# EAGLE design FRDM-Robot-Rev2.1 (EAGLE 6.4)
FRDM-Robot Board
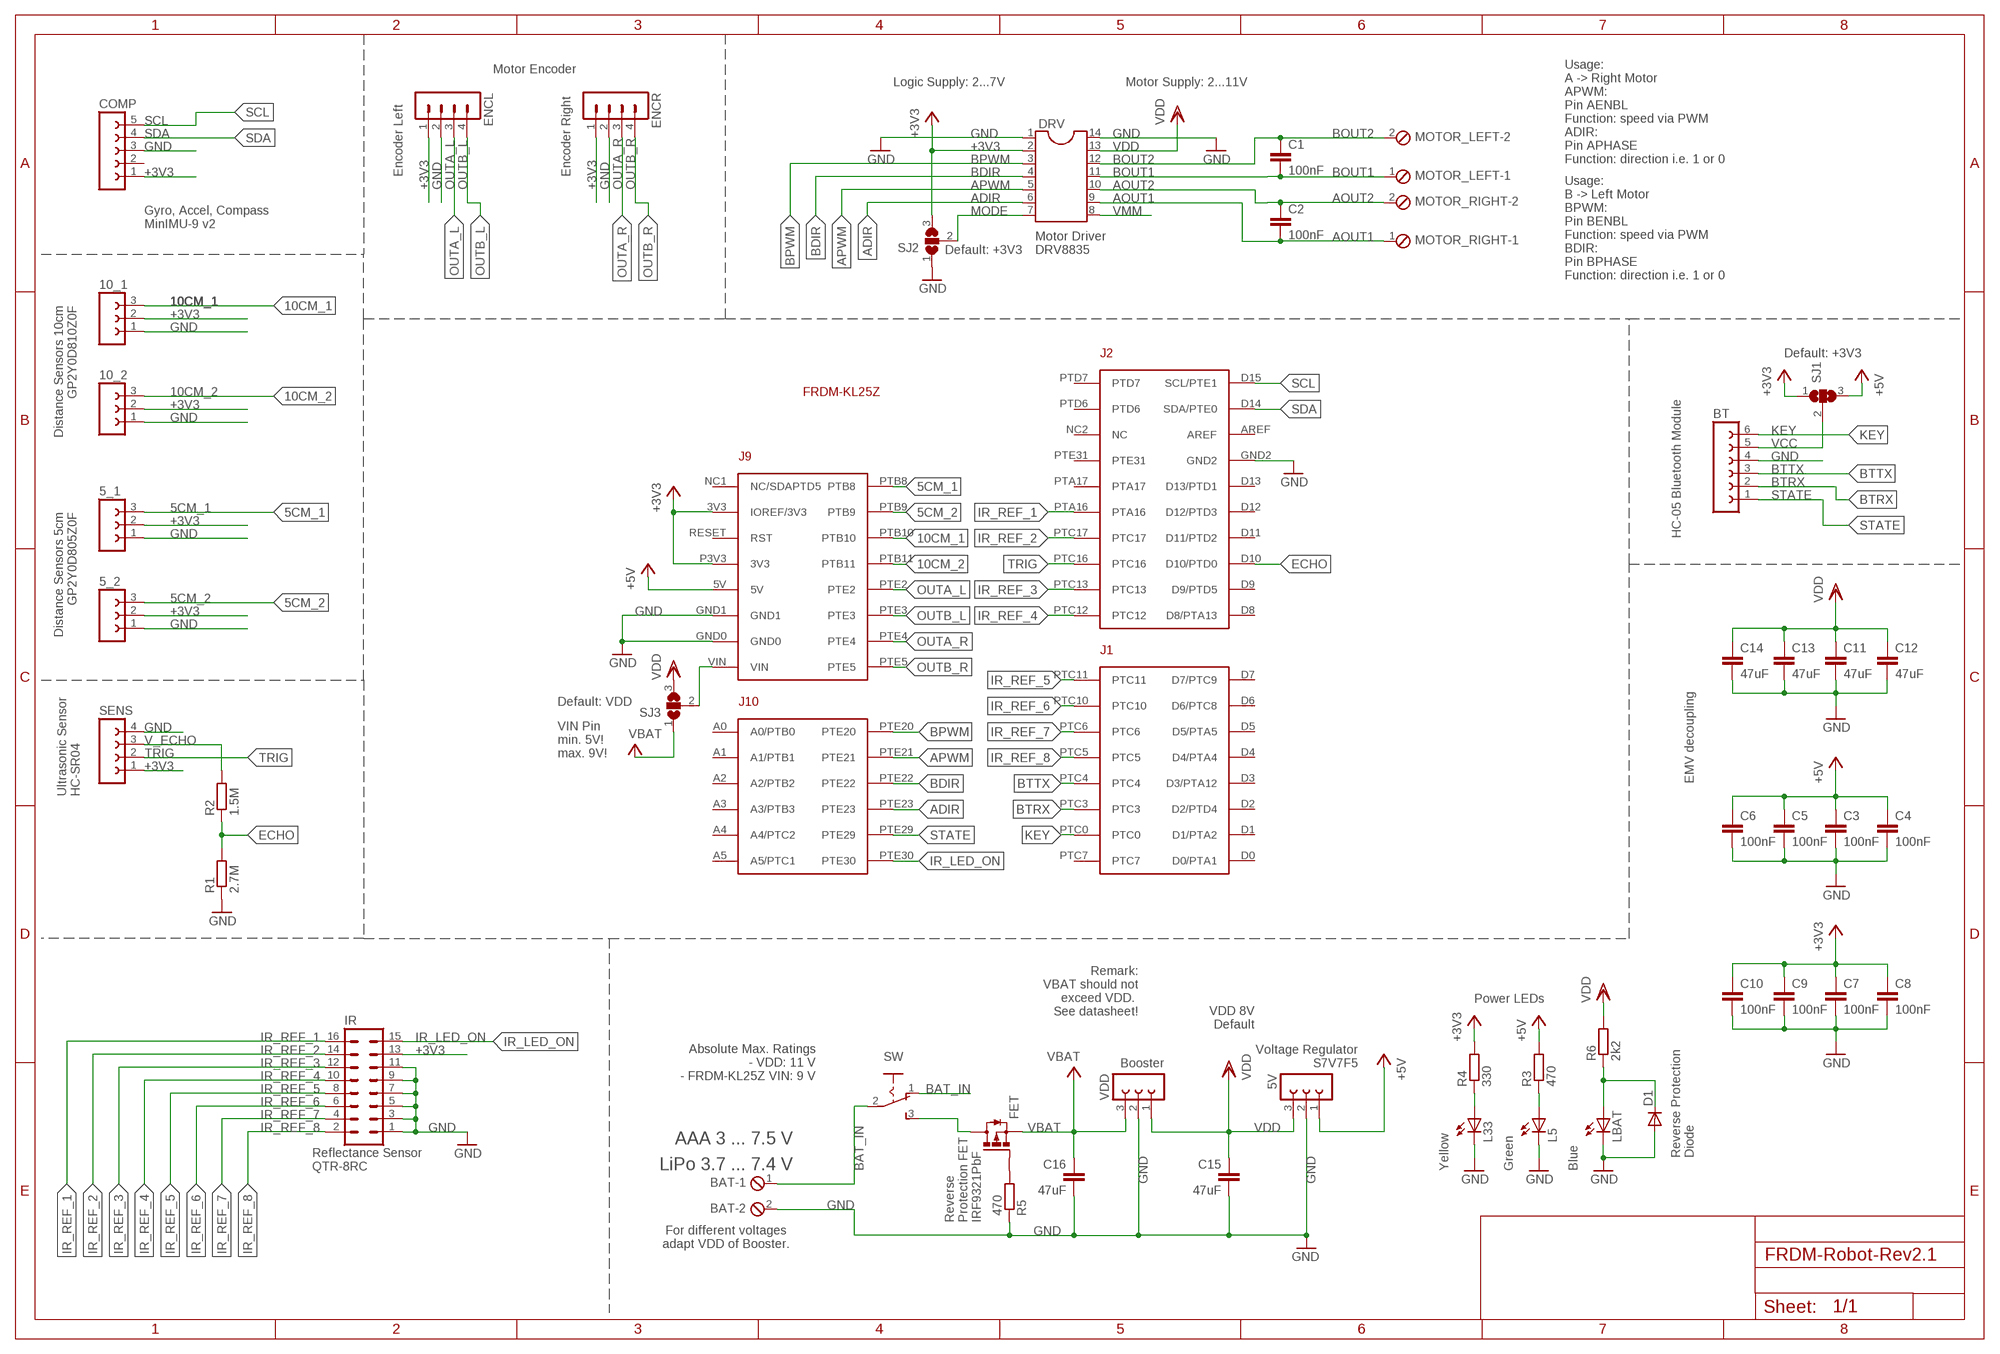
[diagram p0: schematic, sheet 1]

## Parts
5_1  FE03-1  [FE03-1]
5_2  FE03-1  [FE03-1]
5V  FE03-1  [FE03-1]
10_1  FE03-1  [FE03-1]
10_2  FE03-1  [FE03-1]
BAT  MPT2  [2POL254]
BT  FE06-1  [FE06]
C1  100nF  C-EUC0805  [C0805]
C2  100nF  C-EUC0805  [C0805]
C3  100nF  C-EUC0805  [C0805]
C4  100nF  C-EUC0805  [C0805]
C5  100nF  C-EUC0805  [C0805]
C6  100nF  C-EUC0805  [C0805]
C7  100nF  C-EUC0805  [C0805]
C8  100nF  C-EUC0805  [C0805]
C9  100nF  C-EUC0805  [C0805]
C10  100nF  C-EUC0805  [C0805]
C11  47uF  C-EUC0805  [C0805]
C12  47uF  C-EUC0805  [C0805]
C13  47uF  C-EUC0805  [C0805]
C14  47uF  C-EUC0805  [C0805]
C15  47uF  C-EUC0805  [C0805]
C16  47uF  C-EUC0805  [C0805]
COMP  FE05-1  [FE05-1]
D1  DIODE-SOD123  [SOD123]
DRV  DIL14  [DIL14]
ENCL  MA04-1  [MA04-1]
ENCR  MA04-1  [MA04-1]
FET  P-MOSFET-SO8  [SO-08]
FRDM1  FRDM-KL25ZARDUINO  [FRDM-KL25Z]
IR  MA08-2  [MA08-2]
L5  LEDCHIP-LED0603  [CHIP-LED0603]
L33  LEDCHIP-LED0603  [CHIP-LED0603]
LBAT  LEDCHIP-LED0603  [CHIP-LED0603]
MOTOR_LEFT  MPT2  [2POL254]
MOTOR_RIGHT  MPT2  [2POL254]
R1  2.7M  R-EU_M0805  [M0805]
R2  1.5M  R-EU_M0805  [M0805]
R3  470  R-EU_M0805  [M0805]
R4  330  R-EU_M0805  [M0805]
R5  470  R-EU_M0805  [M0805]
R6  2k2  R-EU_M0805  [M0805]
SENS  FE04-1  [FE04-1]
SJ1  SJ2W  [SJ_2]
SJ2  SJ2W  [SJ_2]
SJ3  SJ2W  [SJ_2]
SW  KNITTER-MFP106D  [KNITTER-MFP106D]
VDD  FE03-1  [FE03-1]

## Nets
5CM_1: 5_1.3 FRDM1.PTB8
5CM_2: 5_2.3 FRDM1.PTB9
10CM_1: 10_1.3 FRDM1.PTB10
10CM_2: 10_2.3 FRDM1.PTB11
+3V3: 5_1.2 5_2.2 10_1.2 10_2.2 C7.1 C8.1 C9.1 C10.1 COMP.1 DRV.2 ENCL.1 ENCR.1 FRDM1.3V3(IOREF/3V3) FRDM1.P3V3(3V3) IR.13 R4.2 SENS.1 SJ1.1 SJ2.3
+5V: 5V.1 C3.1 C4.1 C5.1 C6.1 FRDM1.5V R3.2 SJ1.3
ADIR: DRV.6 FRDM1.PTE23
AOUT1: C2.2 DRV.9 MOTOR_RIGHT.1
AOUT2: C2.1 DRV.10 MOTOR_RIGHT.2
APWM: DRV.5 FRDM1.PTE21
BAT-FET: FET.5(D) FET.6(D) FET.7(D) FET.8(D) SW.3(S)
BAT_IN: BAT.1 SW.1(O) SW.2(P)
BDIR: DRV.4 FRDM1.PTE22
BOUT1: C1.2 DRV.11 MOTOR_LEFT.1
BOUT2: C1.1 DRV.12 MOTOR_LEFT.2
BPWM: DRV.3 FRDM1.PTE20
BTRX: BT.2 FRDM1.PTC3
BTTX: BT.3 FRDM1.PTC4
ECHO: FRDM1.D10(D10/PTD0) R1.2 R2.1
GND: 5_1.1 5_2.1 5V.2 10_1.1 10_2.1 BAT.2 BT.4 C3.2 C4.2 C5.2 C6.2 C7.2 C8.2 C9.2 C10.2 C11.2 C12.2 C13.2 C14.2 C15.2 C16.2 COMP.3 D1.A DRV.1 DRV.14 ENCL.2 ENCR.2 FRDM1.GND0 FRDM1.GND1 FRDM1.GND2 IR.1 IR.3 IR.5 IR.7 IR.9 IR.11 L5.C L33.C LBAT.C R1.1 R5.1 SENS.4 SJ2.1 VDD.2
IR_LED_ON: FRDM1.PTE30 IR.15
IR_REF_1: FRDM1.PTA16 IR.16
IR_REF_2: FRDM1.PTC17 IR.14
IR_REF_3: FRDM1.PTC13 IR.12
IR_REF_4: FRDM1.PTC12 IR.10
IR_REF_5: FRDM1.PTC11 IR.8
IR_REF_6: FRDM1.PTC10 IR.6
IR_REF_7: FRDM1.PTC6 IR.4
IR_REF_8: FRDM1.PTC5 IR.2
KEY: BT.6 FRDM1.PTC0
MODE: DRV.7 SJ2.2
N$1: L5.A R3.1
N$3: L33.A R4.1
N$5: FET.4(G) R5.2
N$6: D1.C LBAT.A R6.1
OUTA_L: ENCL.3 FRDM1.PTE2
OUTA_R: ENCR.3 FRDM1.PTE4
OUTB_L: ENCL.4 FRDM1.PTE3
OUTB_R: ENCR.4 FRDM1.PTE5
SCL: COMP.5 FRDM1.D15(SCL/PTE1)
SDA: COMP.4 FRDM1.D14(SDA/PTE0)
STATE: BT.1 FRDM1.PTE29
TRIG: FRDM1.PTC16 SENS.2
V_ECHO: R2.2 SENS.3
VBAT: C16.1 FET.1(S) FET.2(S) FET.3(S) SJ3.1 VDD.3
VCC: BT.5 SJ1.2
VDD: 5V.3 C11.1 C12.1 C13.1 C14.1 C15.1 DRV.13 R6.2 SJ3.3 VDD.1
VIN: FRDM1.VIN SJ3.2
VMM: DRV.8
Unconnected: COMP.2 FRDM1.A0(A0/PTB0) FRDM1.A1(A1/PTB1) FRDM1.A2(A2/PTB2) FRDM1.A3(A3/PTB3) FRDM1.A4(A4/PTC2) FRDM1.A5(A5/PTC1) FRDM1.AREF FRDM1.D0(D0/PTA1) FRDM1.D1(D1/PTA2) FRDM1.D2(D2/PTD4) FRDM1.D3(D3/PTA12) FRDM1.D4(D4/PTA4) FRDM1.D5(D5/PTA5) FRDM1.D6(D6/PTC8) FRDM1.D7(D7/PTC9) FRDM1.D8(D8/PTA13) FRDM1.D9(D9/PTD5) FRDM1.D11(D11/PTD2) FRDM1.D12(D12/PTD3) FRDM1.D13(D13/PTD1) FRDM1.NC1(NC/SDAPTD5) FRDM1.NC2(NC) FRDM1.PTA17 FRDM1.PTC7 FRDM1.PTD6 FRDM1.PTD7 FRDM1.PTE31 FRDM1.RESET(RST)

## Notes on the sheet
- Motor Encoder
- Logic Supply: 2...7V | Motor Supply: 2...11V
- Usage:
  A -> Right Motor
  APWM: 
  Pin AENBL 
  Function: speed via PWM
  ADIR: 
  Pin APHASE 
  Function: direction i.e. 1 or 0
- Encoder Left | Encoder Right
- Gyro, Accel, Compass
  MinIMU-9 v2
- Default: +3V3
- Motor Driver
  DRV8835
- Usage:
  B -> Left Motor
  BPWM: 
  Pin BENBL 
  Function: speed via PWM
  BDIR: 
  Pin BPHASE 
  Function: direction i.e. 1 or 0
- Distance Sensors 10cm
  GP2Y0D810Z0F
- Default: +3V3
- Distance Sensors 5cm
  GP2Y0D805Z0F
- HC-05 Bluetooth Module
- Default: VDD
- VIN Pin
  min. 5V!
  max. 9V!
- EMV decoupling
- Ultrasonic Sensor
  HC-SR04
- Power LEDs
- Remark:
  VBAT should not
  exceed VDD. 
  See datasheet!
- VDD 8V
  Default
- Booster
- Voltage Regulator
  S7V7F5
- Absolute Max. Ratings
  - VDD: 11 V
  - FRDM-KL25Z VIN: 9 V
- AAA 3 ... 7.5 V
- Reverse Protection
  Diode
- Reflectance Sensor
  QTR-8RC
- LiPo 3.7 ... 7.4 V | Yellow | Green | Blue
- Reverse
  Protection FET
  IRF9321PbF
- For different voltages 
  adapt VDD of Booster.

## Library data of the parts
5_1 5_2 5V 10_1 10_2 VDD = con-lsta-FRDM:FE03-1: Female Header
BAT MOTOR_LEFT MOTOR_RIGHT = con-phoenix-254-FRDM:MPT2: PHOENIX CONNECTOR; OC_FARNELL: unknown; OC_NEWARK: unknown
BT = con-lsta-FRDM:FE06-1: FEMALE HEADER; OC_FARNELL: unknown; OC_NEWARK: unknown
C1-C16 = rcl:C-EU: CAPACITOR, European symbol
COMP = con-lsta-FRDM:FE05-1: FEMALE HEADER; OC_FARNELL: unknown; OC_NEWARK: unknown
D1 = diode:DIODE-: DIODE
DRV = ic-package-FRDM:DIL14: Dual In Line / Socket
ENCL ENCR = con-lstb-FRDM:MA04-1: PIN HEADER; OC_FARNELL: unknown; OC_NEWARK: unknown
FET = transistor-power-IRF-FRDM:P-MOSFET-SO8: P-Channel MOSFET Example: FDS4435A; P-Channel Logic Level PowerTrench® MOSFET FDS4465; P-Channel 1.8V Specified PowerTrench® MOSFET Source: www.fairchildsemi.com
FRDM1 = Freedom:FRDM-KL25Z: For creating FRDM-KL25Z shields
IR = con-lstb-FRDM:MA08-2: PIN HEADER; OC_FARNELL: unknown; OC_NEWARK: unknown
L5 L33 LBAT = led:LED: LED OSRAM: - CHIPLED LG R971, LG N971, LY N971, LG Q971, LY Q971, LO R971, LY R971 LH N974, LH R974 LS Q976, LO Q976, LY Q976 LO Q996 - Hyper CHIPLED LW Q18S LB Q993, LB Q99A, LB R99A - SideLED LS A670, LO A670, LY A670, LG A670, LP A670 LB A673, LV A673, LT A673, LW A673 LH A674 LY A675 LS A676, LA A676, LO A676, LY A676, LW A676 LS A679, LY A679, LG A679 - Hyper Micro SIDELED® LS Y876, LA Y876, LO Y876, LY Y876 LT Y87S - SmartLED LW L88C, LW L88S LB L89C, LB L89S, LG L890 LS L89K, LO L89K, LY L89K LS L896, LA L896, LO L896, LY L896 - TOPLED LS T670, LO T670, LY T670, LG T670, LP T670 LSG T670, LSP T670, LSY T670, LOP T670, LYG T670 LG T671, LOG T671, LSG T671 LB T673, LV T673, LT T673, LW T673 LH T674 LS T676, LA T676, LO T676, LY T676, LB T676, LH T676, LSB T676, LW T676 LB T67C, LV T67C, LT T67C, LS T67K, LO T67K, LY T67K, LW E67C LS E67B, LA E67B, LO E67B, LY E67B, LB E67C, LV E67C, LT E67C LW T67C LS T679, LY T679, LG T679 LS T770, LO T770, LY T770, LG T770, LP T770 LB T773, LV T773, LT T773, LW T773 LH T774 LS E675, LA E675, LY E675, LS T675 LS T776, LA T776, LO T776, LY T776, LB T776 LHGB T686 LT T68C, LB T68C - Hyper Mini TOPLED® LB M676 - Mini TOPLED Santana® LG M470 LS M47K, LO M47K, LY M47K Source: http://www.osram.convergy.de LUXEON: - LUMILED® LXK2-PW12-R00, LXK2-PW12-S00, LXK2-PW14-U00, LXK2-PW14-V00 LXK2-PM12-R00, LXK2-PM12-S00, LXK2-PM14-U00 LXK2-PE12-Q00, LXK2-PE12-R00, LXK2-PE12-S00, LXK2-PE14-T00, LXK2-PE14-U00 LXK2-PB12-K00, LXK2-PB12-L00, LXK2-PB12-M00, LXK2-PB14-N00, LXK2-PB14-P00, LXK2-PB14-Q00 LXK2-PR12-L00, LXK2-PR12-M00, LXK2-PR14-Q00, LXK2-PR14-R00 LXK2-PD12-Q00, LXK2-PD12-R00, LXK2-PD12-S00 LXK2-PH12-R00, LXK2-PH12-S00 LXK2-PL12-P00, LXK2-PL12-Q00, LXK2-PL12-R00 Source: www.luxeon.com KINGBRIGHT: KA-3528ASYC Source: www.kingbright.com
R1-R6 = resistor:R-EU_: RESISTOR, European symbol
SENS = con-lsta-FRDM:FE04-1: Female Header
SJ1-SJ3 = jumper:SJ2W: SMD solder JUMPER
SW = switch-FRDM:KNITTER-MFP106D: SLIDING SWITCH Knitter-Switch MFP 106 D Farnell <http://ch.farnell.com/knitter-switch/mfp106d/schiebeschalter-ein-ein/dp/807527>; FARNELL: 807527

## Net classes
0 default: clearance 0.025 mm

## Board
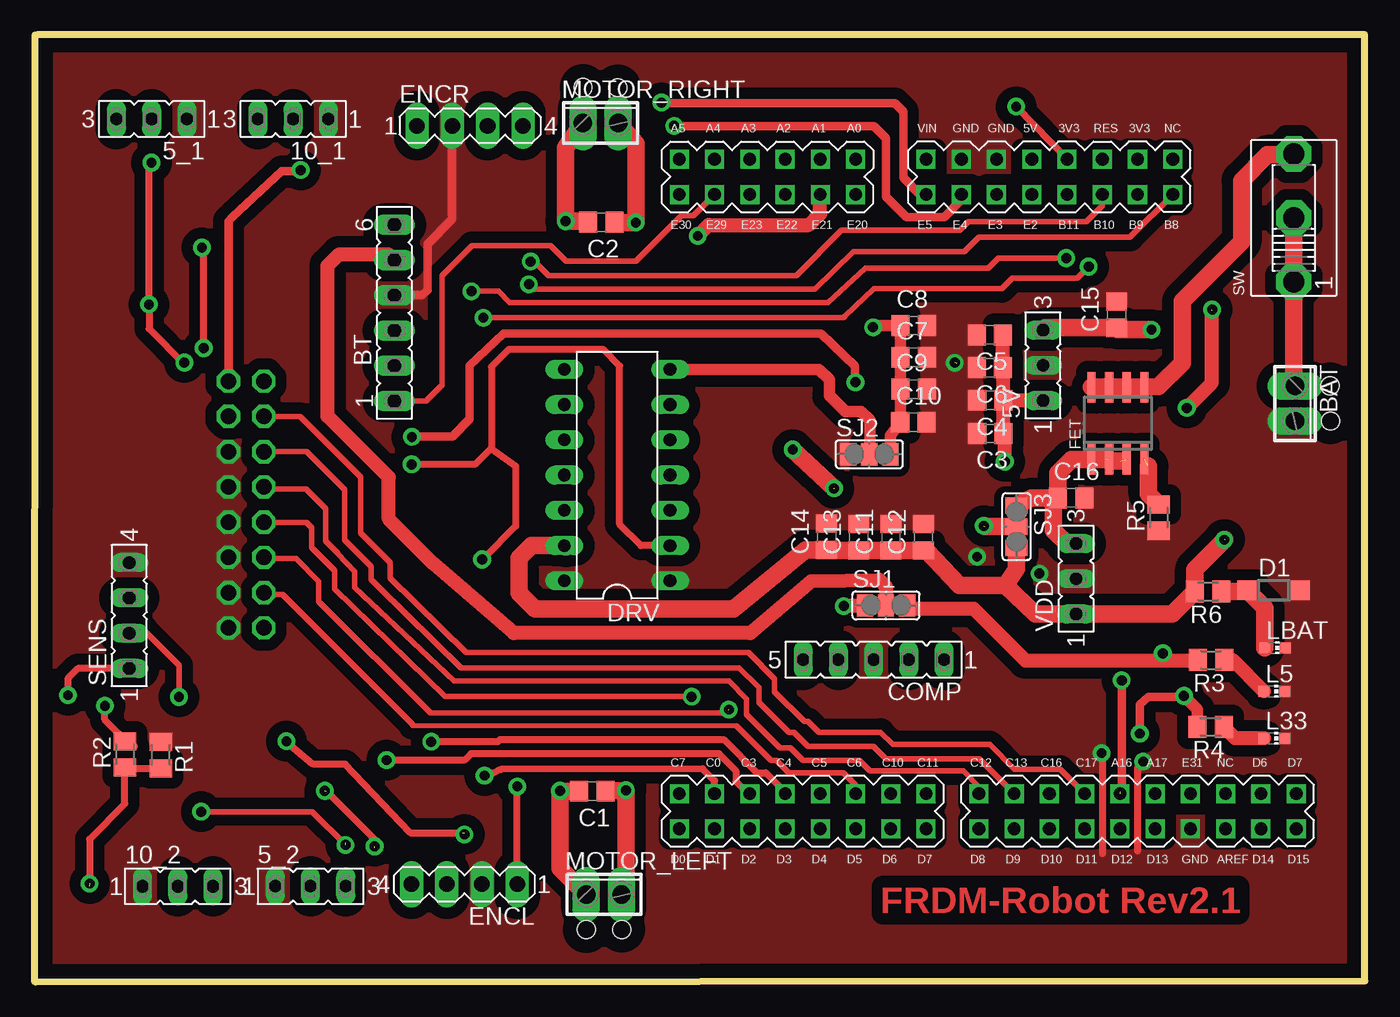
[diagram p1: board, top side]
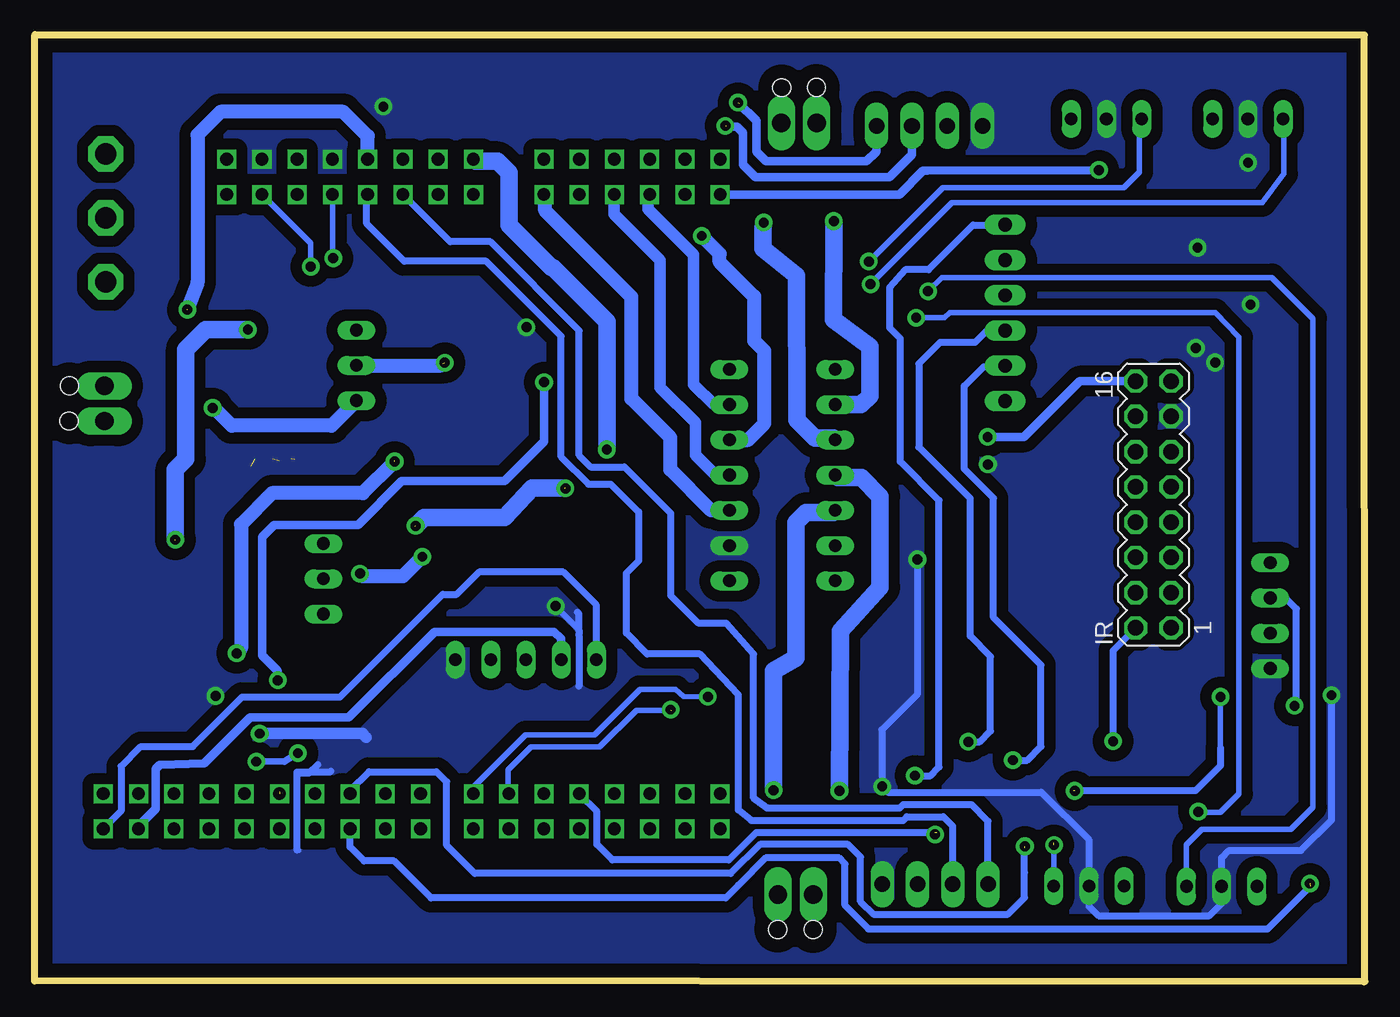
[diagram p2: board, bottom side, seen from below]

Size 95.84 x 68.27 mm. Coordinates in mm from the lower left corner, seen from the top.
Outline: 0.04,0 95.84,0.07 95.83,68.27 0.14,68.25
Outline: 0,0.02 0.03,68.24
Copper layers (1*16): Top 0.035mm / dielectric 1.5mm / Bottom 0.035mm
Design rules "default *": minimum track width 10mil, minimum drill 24mil, track to track 3mil, track to pad 3mil, pad to pad 3mil, via to via 3mil, smd to smd 3mil, copper to edge 40mil, drill to drill 5mil, minimum pad ring 5mil, minimum via ring 4mil, stop-mask expansion 3mil, vias tented up to drill 0mil, thermal gap 10mil
Holes 1.3 mm at 39.74,3.79 42.3,3.79 93.36,40.42 93.34,42.96 39.51,64.46 42.01,64.44

### Footprints (pad centres in the part's own frame; a part is rotated, then mirrored left to right if it is on the bottom)
FE03-1 = drill 0.914 long: 1 -2.54,0; 2 0,0; 3 2.54,0
2POL254 = drill 1.321 long: 1 -1.27,0; 2 1.27,0
FE06 = drill 0.991 long: 1 -6.35,0; 2 -3.81,0; 3 -1.27,0; 4 1.27,0; 5 3.81,0; 6 6.35,0
C0805 = smd 1.3 x 1.5: 1 -0.95,0; 2 0.95,0
FE05-1 = drill 0.914 long: 1 -5.08,0; 2 -2.54,0; 3 0,0; 4 2.54,0; 5 5.08,0
SOD123 = smd 1.4 x 1.4: A 1.9,0; C -1.9,0
DIL14 = drill 0.914 long: 1 -7.62,-3.81; 2 -5.08,-3.81; 3 -2.54,-3.81; 4 0,-3.81; 5 2.54,-3.81; 6 5.08,-3.81; 7 7.62,-3.81; 8 7.62,3.81; 9 5.08,3.81; 10 2.54,3.81; 11 0,3.81; 12 -2.54,3.81; 13 -5.08,3.81; 14 -7.62,3.81
MA04-1 = drill 1.118 long: 1 -3.81,0; 2 -1.27,0; 3 1.27,0; 4 3.81,0
SO-08 = smd 0.6 x 2.2: 1 -1.905,-2.6; 2 -0.635,-2.6; 3 0.635,-2.6; 4 1.905,-2.6; 5 1.905,2.6; 6 0.635,2.6; 7 -0.635,2.6; 8 -1.905,2.6
FRDM-KL25Z = drill 0.914 square: 3V3 -22.86,12.7; 5V -22.86,5.08; A0 -22.86,-7.62; A1 -22.86,-10.16; A2 -22.86,-12.7; A3 -22.86,-15.24; A4 -22.86,-17.78; A5 -22.86,-20.32; AREF 25.4,19.05; D0 25.4,-20.32; D1 25.4,-17.78; D2 25.4,-15.24; D3 25.4,-12.7; D4 25.4,-10.16; D5 25.4,-7.62; D6 25.4,-5.08; D7 25.4,-2.54; D8 25.4,1.27; D9 25.4,3.81; D10 25.4,6.35; D11 25.4,8.89; D12 25.4,11.43; D13 25.4,13.97; D14 25.4,21.59; D15 25.4,24.13; GND0 -22.86,0; GND1 -22.86,2.54; GND2 25.4,16.51; NC1 -22.86,15.24; NC2 22.86,19.05; P3V3 -22.86,7.62; PTA16 22.86,11.43; PTA17 22.86,13.97; PTB8 -20.32,15.24; PTB9 -20.32,12.7; PTB10 -20.32,10.16; PTB11 -20.32,7.62; PTC0 22.86,-17.78; PTC3 22.86,-15.24; PTC4 22.86,-12.7; PTC5 22.86,-10.16; PTC6 22.86,-7.62; PTC7 22.86,-20.32; PTC10 22.86,-5.08; PTC11 22.86,-2.54; PTC12 22.86,1.27; PTC13 22.86,3.81; PTC16 22.86,6.35; PTC17 22.86,8.89; PTD6 22.86,21.59; PTD7 22.86,24.13; PTE2 -20.32,5.08; PTE3 -20.32,2.54; PTE4 -20.32,0; PTE5 -20.32,-2.54; PTE20 -20.32,-7.62; PTE21 -20.32,-10.16; PTE22 -20.32,-12.7; PTE23 -20.32,-15.24; PTE29 -20.32,-17.78; PTE30 -20.32,-20.32; PTE31 22.86,16.51; RESET -22.86,10.16; VIN -22.86,-2.54
MA08-2 = drill 1.118 octagon: 1 -8.89,-1.27; 2 -8.89,1.27; 3 -6.35,-1.27; 4 -6.35,1.27; 5 -3.81,-1.27; 6 -3.81,1.27; 7 -1.27,-1.27; 8 -1.27,1.27; 9 1.27,-1.27; 10 1.27,1.27; 11 3.81,-1.27; 12 3.81,1.27; 13 6.35,-1.27; 14 6.35,1.27; 15 8.89,-1.27; 16 8.89,1.27
CHIP-LED0603 = smd 0.8 x 0.8: A 0,-0.75; C 0,0.75
M0805 = smd 1.3 x 1.6: 1 -0.95,0; 2 0.95,0
FE04-1 = drill 0.914 long: 1 -5.08,0; 2 -2.54,0; 3 0,0; 4 2.54,0
SJ_2 = smd 1.168 x 1.6: 1 -1.524,0; 2 0,0; 3 1.524,0
KNITTER-MFP106D = drill 1.524 pad 2.54 octagon: 1 -4.61,0; 2 0,0; 3 4.61,0

### Placement (x,y rotation side)
5_1  8.43,62.2 180 top
5_2  19.88,6.9 0 top
5V  72.65,44.44 90 top
10_1  18.62,62.19 180 top
10_2  10.31,6.89 0 top
BAT  90.82,41.69 270 top
BT  25.92,48.22 90 top
C1  40.19,13.75 180 top
C2  40.83,54.75 180 top
C3  68.86,39.53 180 top
C4  68.86,41.93 180 top
C5  68.83,46.63 180 top
C6  68.83,44.27 180 top
C7  63.34,45.02 0 top
C8  63.34,47.31 0 top
C9  63.33,42.72 0 top
C10  63.31,40.34 0 top
C11  61.69,32.05 90 top
C12  64.04,32.04 90 top
C13  59.37,32.06 90 top
C14  57.06,32.08 90 top
C15  77.95,48.09 90 top
C16  74.68,34.89 0 top
COMP  60.44,23.22 180 top
D1  89.27,28.23 0 top
DRV  41.97,36.53 90 top
ENCL  30.96,7.04 180 top
ENCR  31.36,61.71 0 top
FET  78.04,40.27 0 top
FRDM1  66.77,36.43 270 top
IR  15.23,34.41 90 bottom
L5  89.32,20.95 270 top
L33  89.32,17.56 270 top
LBAT  89.37,24.08 270 top
MOTOR_LEFT  41.01,6.31 0 top
MOTOR_RIGHT  40.77,61.92 0 top
R1  9.1,16.36 270 top
R2  6.5,16.4 90 top
R3  84.77,23.21 180 top
R4  84.72,18.39 180 top
R5  80.99,33.47 90 top
R6  84.54,28.14 180 top
SENS  6.81,27.68 90 top
SJ1  61.34,27.14 0 top
SJ2  60.13,38.04 0 top
SJ3  70.75,32.81 270 top
SW  90.73,55.07 90 top
VDD  75.03,29.06 90 top

### Tracks (layer width: path | path; a pad name or v marks a point on that pad's centre or on a via)
5CM_1  (via drill 0.71 pad 1.27)
  Top 0.406: v35.61,50.29 35.96,49.94 56.23,49.94 58.98,52.62 66.99,52.62 68.03,53.66 78.92,53.66 FRDM1.PTB8
  Bottom 0.406: 5_1.3 5.82,62.13 5.82,58.24 7.4,56.16 28.57,56.16 | 28.57,56.15 28.57,56.16 | v35.61,50.29 29.73,56.16 28.57,56.16
5CM_2  (via drill 0.71 pad 1.27)  (1 unrouted)
  Top 0.406: v32.33,47.87 58.26,47.87 58.37,47.98 60.48,49.96 69.68,49.96 70.44,50.72 75.11,50.72 v75.95,51.56 | v22.4,9.88 20,12.28 v12,12.28
  Bottom 0.406: 5_2.3 22.41,10.02 | v32.33,47.87 30.28,47.87 29.91,48.25 10.78,48.25 9.07,46.48 9.07,13.56 10.42,12.21 11.93,12.21 v12,12.28 | v75.95,51.56 75.95,53.24 FRDM1.PTB9
10CM_1  (via drill 0.71 pad 1.27)
  Top 0.406: FRDM1.PTB10 76.93,55.94 75.78,54.78 67.29,54.78 66.68,54.17 58.15,54.17 54.89,50.91 37.03,50.91 36.02,51.92 v35.74,51.92
  Bottom 0.406: 10_1.3 16.26,62.01 16.26,58.36 17.38,57.25 30.42,57.25 v35.74,51.92
  Bottom 0.61: 16.24,62.04 10_1.3
10CM_2  (via drill 0.71 pad 1.27)
  Top 0.406: v74.33,52.17 69.42,52.17 68.71,51.45 59.87,51.45 57.17,48.96 34.23,48.96 33.41,49.78 v31.47,49.78
  Bottom 0.406: FRDM1.PTB11 74.39,52.23 v74.33,52.17 | 10_2.3 12.85,9.88 11.74,10.99 5.34,10.99 3.74,12.6 3.74,47.82 6.69,50.77 30.48,50.77 v31.47,49.78
  Bottom 0.61: 74.39,52.23 74.43,52.19
+3V3  (via drill 0.71 pad 1.27)
  Top 0.406: 8.42,48.64 v8.24,48.83
  Top 0.508: v70.72,63.09 74.4,59.31 FRDM1.P3V3 | DRV.2 43.68,31.45 42.15,32.99 42.15,44.4 40.94,45.61 34.16,45.61 32.91,44.35 32.91,38.48 32.87,38.45 | 32.87,38.45 31.73,37.31 v27.16,37.31 | 32.87,38.45 34.65,37.18 34.65,32.86 32.37,30.57 | v12.17,45.69 12.17,52.8 v12.05,52.93 | ENCL.1 34.77,13.68 v34.78,14.09 | 10.78,44.55 8.24,47.09 v8.24,48.83 8.24,58.87 v8.41,59.04 | SENS.1 3.12,22.6 2.4,21.88 v2.4,20.68
  Top 0.61: v82.81,20.62 82.73,20.54 80.25,20.54 79.63,20 v79.63,17.9 | 34.86,6.95 ENCL.1
  Top 0.813: R4.2 83.77,19.66 v82.81,20.62 | SJ2.3 61.66,39.38 C10.1 62.38,40.35 C9.1 62.39,42.73 C7.1 C8.1 60.53,47.31 v60.41,47.19
  Top 1.016: SJ1.1 59.77,27.09 v58.3,27.09
  Bottom 0.406: 56.62,24.99 56.62,25.06 | 56.62,25.37 58.27,27.02 | 76.82,9.49 76.94,9.49
  Bottom 0.508: 56.62,24.99 56.62,21.3 | 76.94,9.49 76.94,15.08 76.03,15.08 75.98,15.13 | 76.94,15.13 75.98,15.13 | 75.98,15.13 75.44,15.66 | 75.98,15.13 74.56,15.13 74.51,15.18 | 56.62,25.06 56.62,25.37 56.62,26.54 56.75,26.66 | 2.4,20.78 v2.4,20.68 2.4,11.68 4.6,9.48 9.8,9.48 10.31,8.96 10_2.2 10.3,6.88 10.3,5.68 11.2,4.78 19.2,4.78 19.88,5.45 5_2.2 19.9,6.93 19.9,10.28 23.3,13.68 34.37,13.68 v34.78,14.09 34.8,13.7 34.8,18.18 32.24,20.73 v32.24,30.45 | v12.17,45.69 11.83,45.69 | 27.09,37.38 v27.16,37.31
  Bottom 0.813: v79.63,17.9 72.22,17.9 71.97,17.65
  other vias: 10.78,44.64
  pour Bottom (isolate 0.813, no thermals): 0.23,-0.27 95.65,-0.01 95.68,68.8 -0.04,68.44
+5V  (via drill 0.71 pad 1.27)  (2 unrouted)
  Top 1.016: 69.92,37.57 69.92,39.42 C3.1 69.81,41.14 | 69.81,41.14 C4.1 69.81,44.24 C6.1 | C6.1 C5.1 | C5.1 | 69.81,44.24 C6.1 | 5V.1 69.94,41.9 69.81,41.14 | 81.27,23.17 71.39,23.17 67.67,26.89 63.11,26.89 SJ1.3 | 81.27,23.17 83.78,23.17 R3.2 | 81.27,23.17 81.27,23.68 v81.29,23.69 | v83.01,41.37 84.82,43.17 84.82,48.41
  Bottom 1.016: FRDM1.5V 71.85,60.96 73.6,62.72 82.45,62.72 82.45,62.71 84.11,61.06 84.11,50.42 v84.85,48.46 | v81.29,23.69 80.98,24.05 80.98,32.99 78.75,35.22 72.2,35.22 v69.91,37.51 | 5V.1 74.45,40.1 81.64,40.1 82.91,41.37 v83.01,41.37
ADIR
  Bottom 0.813: DRV.6 46.91,41.61 48.37,43.07 48.37,52.42 51.65,55.7 51.65,56.64 FRDM1.PTE23
AOUT1  (via drill 0.71 pad 1.27)
  Top 1.27: C2.2 39.8,54.83 v38.26,54.83 38.26,60.11 MOTOR_RIGHT.1
  Bottom 1.27: DRV.9 36.29,41.61 35.67,42.23 35.67,45.78 38.28,47.74 38.26,54.55 v38.26,54.83
AOUT2  (via drill 0.71 pad 1.27)
  Top 1.27: C2.1 41.8,54.73 v43.31,54.73 43.31,60.42 MOTOR_RIGHT.2
  Bottom 1.27: v43.31,54.73 43.36,54.27 43.36,52.85 40.95,50.9 40.93,40.63 40.93,40.51 39.63,39.21 38.3,39.21 DRV.10
APWM  (via drill 0.71 pad 1.27)
  Top 1.016: FRDM1.PTE21 56.6,56.74 56.6,55.37 55.79,54.55 48.56,54.55 v47.78,53.77
  Bottom 1.016: DRV.5 44.45,39.07 43.26,40.25 43.26,45.49 44,46.22 44,49.4 46.49,51.89 46.49,52.48 v47.78,53.77
BAT-FET
  Top 1.27: FET.8 FET.7 FET.6 FET.5 80.97,42.9 82.68,44.62 82.68,49.07 86.98,53.36 86.98,57.75 88.83,59.61 90.28,59.61 SW.3
BAT_IN
  Top 1.27: SW.2 SW.1 90.73,43.44 BAT.1
BDIR
  Bottom 0.813: DRV.4 46.78,36.53 48.24,37.99 48.24,40.3 50.78,42.84 50.78,52.04 54.08,55.34 54.08,56.74 FRDM1.PTE22
BOUT1  (via drill 0.71 pad 1.27)
  Top 1.27: MOTOR_LEFT.1 37.85,8.21 v37.85,13.77 37.93,13.7 37.98,13.75 C1.2
  Bottom 1.27: v37.85,13.77 37.78,25.29 34.93,28.44 34.93,35 36.28,36.34 37.97,36.34 DRV.11
BOUT2  (via drill 0.71 pad 1.27)
  Top 1.27: 42.31,13.67 v42.6,13.82 | MOTOR_LEFT.2 42.6,6.5 v42.6,13.82 | C1.1 41.15,13.77 v42.6,13.82
  Bottom 1.27: DRV.12 38.3,33.85 40.27,33.85 41,33.12 41,23.34 42.6,22.43 42.6,13.84 v42.6,13.82
BPWM
  Bottom 1.016: DRV.3 47.11,33.99 50.04,36.93 50.04,39.24 52.84,42.03 52.84,49.37 59.06,55.59 59.06,56.67 FRDM1.PTE20
BTRX  (via drill 0.71 pad 1.27)
  Top 0.508: FRDM1.PTC3 51.4,13.57 50.53,14.45 50.53,15.23 49.31,16.45 31.44,16.45 30.96,15.98 25.37,15.98 v25.36,15.99
  Bottom 0.508: BT.2 25.98,44.35 27.46,44.35 28.85,42.95 28.85,36.97 26.76,34.88 26.76,26.26 23.34,22.83 23.34,16.97 24.31,15.99 v25.36,15.99
BTTX  (via drill 0.71 pad 1.27)
  Top 0.508: 54.03,13.61 FRDM1.PTC4 54.07,13.7 52.69,15.08 52.05,15.08 49.66,17.47 33.52,17.47 33.37,17.32 v28.57,17.32
  Bottom 0.508: 25.97,47 BT.3 25.94,46.93 27.25,46.93 28.09,46.09 30.6,46.09 32.14,44.56 32.14,38.55 28.43,34.85 28.43,24.93 26.97,23.46 26.97,18.09 27.74,17.32 v28.57,17.32
ECHO  (via drill 0.71 pad 1.27)  (1 unrouted)
  Top 0.508: R1.2 6.54,15.41 R2.1 6.5,12.84 3.96,10.3 v3.96,7.1
  Bottom 0.508: FRDM1.D10 73.12,9.73 72.12,8.73 69.96,8.73 67.29,6.06 46.04,6.06 45.13,6.97 45.13,6.98 43.17,8.93 37.87,8.93 37.45,8.52 37.45,5.51 35.77,3.83 6.99,3.83 3.92,6.91
GND  (via drill 0.71 pad 1.27)  (1 unrouted)
  Top 0.508: v79.88,15.88 79.46,15.46 79.46,9.44 | v76.87,16.5 76.94,16.43 76.94,9.24
  Top 0.61: BT.4 27.91,49.49 28.3,49.88 28.3,53.18 30.08,54.96 30.08,61.7 ENCR.2
  Bottom 0.508: v76.87,16.5 77.83,15.89 v79.88,15.88
  Bottom 1.016: 5V.2 66.55,44.44 66.43,44.56 | v67.91,30.65 68.31,30.25 69.32,29.23 72.2,29.23 v72.4,29.43
  other vias: 66.29,44.63
  pour Top (isolate 0.813, no thermals): 0.25,-0.23 95.8,-0.12 95.85,68.38 0.07,68.28
IR_LED_ON  (via drill 0.71 pad 1.27)
  Top 0.61: v19.16,58.52 19.08,58.44 17.81,58.44 14.23,55.11 13.96,54.85 IR.15
  Bottom 0.61: v19.16,58.52 31.52,58.47 31.83,58.47 33.54,56.75 FRDM1.PTE30
IR_REF_1  (via drill 0.71 pad 1.27)  (1 unrouted)
  Top 0.406: 59.11,43.2 v59.14,43.22
  Top 0.61: 59.11,43.2 59.11,44.39 56.64,46.72 33.8,46.72 31.35,44.42 31.35,40.56 30.11,39.32 27.22,39.32 v27.18,39.28 | 78.2,13.71 78.33,13.71 v78.33,21.74
  Bottom 0.61: v59.14,43.22 59.14,38.93 61.98,36.09 69.4,36.09 72.55,32.94 78.59,32.94 79.46,32.07 79.46,23.54 78.33,22.41 v78.33,21.74 | v27.18,39.28 24.56,39.28 20.54,43.3 IR.16
IR_REF_2
  Top 0.406: FRDM1.PTC17 73.89,15.33 70.59,15.33 68.81,17.11 61.83,17.11 60.94,18 56.5,18 55.73,18.76 55.48,18.76 53.32,20.92 53.32,21.84 51.42,23.74 31.1,23.74 25.61,29.1 25.61,30.22 23.48,32.35 23.48,36.4 19.11,40.76 IR.14
IR_REF_3
  Top 0.406: FRDM1.PTC13 68.05,16.1 61.32,16.1 60.43,16.99 55.73,16.99 54.72,18 54.34,18 52.18,20.16 52.18,21.23 50.76,22.65 30.74,22.65 24.82,28.44 24.24,29.03 24.24,29.94 22.33,31.85 22.33,35.48 19.6,38.22 IR.12
IR_REF_4
  Top 0.406: FRDM1.PTC12 68.04,14.08 66.91,15.21 60.18,15.21 59.42,15.97 55.35,15.97 54.46,16.86 53.7,16.86 51.29,19.27 51.29,20.41 50.02,21.68 30.21,21.68 23.07,28.44 23.07,29.58 21.82,30.9 21.82,30.91 20.96,31.77 20.96,34.14 19.56,35.54 16.64,35.54 IR.10
IR_REF_5  (via drill 0.71 pad 1.27)
  Top 0.406: 47.2,20.59 29.57,20.59 21.6,28.34 21.6,29.67 19.97,31.3 19.97,32.75 19.59,33.13 16.52,33.13 IR.8
  Top 0.508: 47.2,20.59 v47.33,20.56
  Bottom 0.406: v47.33,20.56 49.08,20.57 49.66,21.1 52.23,21.1 55.51,17.82 60.46,17.82 64.27,14.01 64.27,13.61
  Bottom 0.508: 64.27,13.61 FRDM1.PTC11
IR_REF_6  (via drill 0.71 pad 1.27)  (1 unrouted)
  Top 0.406: v50.02,19.63 49.79,19.4 28.51,19.4 20.47,27.44 20.47,28.86 18.82,30.51 16.59,30.51 IR.6
  Bottom 0.406: 49.97,19.58 52.48,19.58 55.12,16.93 60.08,16.93 61.73,15.28 61.73,13.61
  Bottom 0.508: FRDM1.PTC10 61.73,13.61
IR_REF_7
  Top 0.406: FRDM1.PTC6 59.15,14.21 58.27,15.08 54.34,15.08 53.45,15.97 53.07,15.97 50.58,18.46 27.23,18.48 27.22,18.48 27.22,18.56 17.86,27.92 16.64,27.92 IR.4
IR_REF_8  (via drill 0.71 pad 1.27)  (1 unrouted)
  Top 0.508: 30.84,10.76 27.06,10.76 22.38,15.69 20.07,15.69 18.21,17.25 v18.14,17.35
  Bottom 0.508: FRDM1.PTC5 55.33,12.29 55.33,9.91 54.21,8.79 45.83,8.79 43.86,10.76 30.97,10.76 v30.97,10.64 | v18.14,17.35 18.14,23.89 IR.2
KEY  (via drill 0.71 pad 1.27)
  Top 0.508: FRDM1.PTC0 48.99,14.5 48.13,15.36 33.57,15.31 32.7,14.87 v32.42,14.87
  Bottom 0.508: BT.6 25.94,54.55 28.23,54.55 31.44,51.33 33.12,51.33 34.23,50.08 34.23,47.14 33.47,46.37 33.47,37.5 30.67,34.71 30.67,15.5 31.3,14.87 v32.42,14.87
MODE
  Top 0.813: SJ2.2 60.18,38.08 60.18,40.48 59.54,41.12 58.4,41.12 57.26,42.26 57.26,43.4 56.51,44.15 DRV.7 45.8,44.16
N$1
  Top 1.016: R3.1 86.31,23.21 L5.A
N$3
  Top 1.016: L33.A 86.5,17.56 R4.1
N$5  (1 unrouted)
  Top 1.27: R5.2 80.25,35.17 80.25,37.18
N$6
  Top 1.27: R6.1 87.29,28.14 D1.C 88.62,26.97 LBAT.A
OUTA_L
  Bottom 0.508: ENCL.3 29.69,11.23 30.37,11.91 33,11.91 33.26,11.65 33.26,11.64 44.21,11.64 45.14,12.39 45.14,20.69 47.91,23.64 51.71,23.64 53.21,25.14 53.21,29.47 52.3,30.37 52.3,33.88 52.33,33.88 54.34,35.88 55.95,35.88 57.91,37.84 57.91,46.54 63.31,51.94 69.21,51.94 71.91,54.64 71.91,56.69 FRDM1.PTE2
OUTA_R  (via drill 0.71 pad 1.27)  (1 unrouted)
  Top 0.61: FRDM1.PTE4 66.77,56.37 65.54,55.14 62.8,55.14 61.35,56.59 61.35,60.8 60.46,61.69 46.03,61.69
  Bottom 0.61: ENCR.3 32.63,59.63 34.27,57.99 43.89,57.99 44.81,58.91 44.81,61.22 45.24,61.65 46.03,61.65 v46.08,61.7
OUTB_L
  Bottom 0.406: 53.35,37.08 53.35,37.13
  Bottom 0.508: ENCL.4 27.15,11.59 28.36,12.79 33.26,12.79 33.51,12.54 43.11,12.54 44.04,13.24 44.04,23.64 46.01,25.84 48.01,25.84 49.99,27.83 49.99,33.78 53.35,37.13 55.79,37.13 56.61,37.94 56.61,46.94 63.01,53.34 65.9,53.34 FRDM1.PTE3
OUTB_R  (via drill 0.71 pad 1.27)  (1 unrouted)
  Top 0.61: FRDM1.PTE5 63.8,56.75 62.59,57.96 62.59,62.73 61.98,63.34 45.07,63.34
  Bottom 0.61: ENCR.4 35.17,59.86 35.89,59.14 43.13,59.14 43.84,59.85 43.84,62.06 v45.16,63.38
SCL
  Bottom 0.508: COMP.5 55.36,27.16 57.74,29.53 63.84,29.53 65.44,27.93 66.43,27.93 73.84,20.53 80.89,20.53 84.45,16.97 88.19,16.97 89.61,15.54 89.61,12.32 FRDM1.D15
SDA
  Bottom 0.61: FRDM1.D14 88.36,11.26 87.13,12.49 87.13,15.36 86.85,15.64 83.62,15.77 80.33,19.06 73.21,19.06 67.03,25.24 58.4,25.24 57.9,24.74 COMP.4
STATE
  Top 0.406: BT.1 28.19,41.87 29.34,43.02 29.34,50.91 31.51,53.08 37.17,53.08 38.28,51.96 43.31,51.96 46.6,55.25 47.48,55.25 FRDM1.PTE29
TRIG  (via drill 0.71 pad 1.27)  (2 unrouted)
  Top 0.406: v10.39,20.54 10.39,22.83 8.11,25.11 6.84,25.11
  Top 0.508: 6.84,25.11 SENS.2 | v24.5,9.78 24.5,10.28 21,13.78
  Bottom 0.406: 10.39,16.86 v10.39,20.54
  Bottom 0.508: FRDM1.PTC16 73.12,13.47 73.11,13.46 73.11,13.81 71.76,15.16 66.89,15.16 66.15,14.43 66.15,9.84 64.13,7.82 45.69,7.82 43.59,9.91 37.24,9.91 36.33,9 36.33,5.79 35.42,4.88 25.71,4.88 24.52,6.07 24.52,7.89 | 24.52,7.89 | 24.52,7.89 24.52,9.65 24.5,9.68 | 10.39,16.86 10.39,15.58 12.2,13.78 v20.9,13.78
V_ECHO  (via drill 0.71 pad 1.27)
  Top 0.508: 7.13,16.97 R2.2 | 6.98,16.97 5.06,18.89 v5.06,19.91
  Top 0.61: 7.13,16.97 6.98,16.97
  Bottom 0.508: SENS.3 5.72,27.68 4.93,26.89 4.93,20.03 v5.06,19.91
VBAT  (2 unrouted)
  Top 1.194: FET.2 77.37,37.67
  Top 1.27: SJ3.1 71.81,34.89 C16.1 | VDD.3 74.37,31.6 73.41,32.56 73.41,34.57 C16.1 | C16.1 73.73,36.68 74.68,37.64 77.12,37.64 FET.1 | FET.2 77.52,37.56 78.21,37.56
VCC
  Top 1.016: SJ1.2 61.32,27.16 61.32,28.52 60.87,28.98 55.96,28.9 51.57,25.14 34.53,25.14 28.81,30.09 28.79,30.09 25.51,33.37 25.51,36.38 21.1,40.79 21.1,51.61 21.94,52.45 25.5,52.45 BT.5
VDD  (via drill 0.71 pad 1.27)  (1 unrouted)
  Top 1.27: 69.93,28.57 72.11,26.52 VDD.1 81.97,26.52 R6.2 83.59,29.73 85.76,31.9 | 69.93,28.57 66.63,28.57 64.24,31.09 C12.1 61.7,31.09 C11.1 C13.1 57.08,31.11 C14.1 55.53,31.13 50.34,26.88 36.06,26.88 34.91,28.04 34.91,30.57 35.8,31.46 38.15,31.46 DRV.13 | v80.47,47.01 78.06,47.03 C15.1 72.82,47.14 5V.3 | 69.93,28.57 70.75,29.76 SJ3.3 | 38.25,31.36 DRV.13 | 38.27,31.34 DRV.13
  Bottom 1.27: v80.47,47.01 83.52,47.01 84.94,45.59 84.94,37.69 85.71,36.93 v85.71,31.87
VIN  (via drill 0.71 pad 1.27)  (3 unrouted)
  Top 1.27: SJ3.2 68.48,32.81 | 57.61,35.55 v54.62,38.37
  Bottom 1.27: FRDM1.VIN 64.09,59.15 62.49,59.15 61.65,58.31 61.65,54.53 58.6,51.48 58.5,51.48 54.62,47.59 v54.62,38.37 | 57.62,35.6 59.99,35.6 62,33.48 67.8,33.48 v68.4,32.88
  other vias: 57.6,35.58

### Text on the board
Top: FRDM-Robot Rev2.1